# Altium schematic sheet Motor driver sheet.SchDoc
size A4
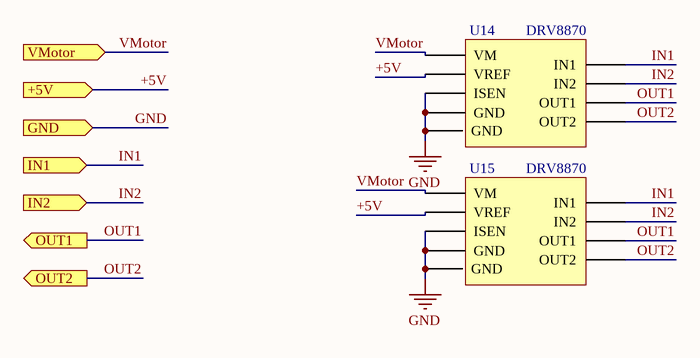
[diagram p0: Motor driver sheet.SchDoc]

## Parts
U14  DRV8870  [8-Pin HSOP]
U15  DRV8870  [8-Pin HSOP]

## Ports
+5V (in), GND (in), IN1 (in), IN2 (in), OUT1 (out), OUT2 (out), VMotor (in)

## Nets
GND: U14.1(GND) U14.7(ISEN) U14.9(GND) U15.1(GND) U15.7(ISEN) U15.9(GND) ; port GND
+5V: U14.4(VREF) U15.4(VREF) ; port +5V
IN1: U14.2(IN1) U15.2(IN1) ; port IN1
IN2: U14.3(IN2) U15.3(IN2) ; port IN2
OUT1: U14.6(OUT1) U15.6(OUT1) ; port OUT1
OUT2: U14.8(OUT2) U15.8(OUT2) ; port OUT2
VMotor: U14.5(VM) U15.5(VM) ; port VMotor

## Library data of the parts
U14 U15 = DRV8870: pin to pad: 8>8+9